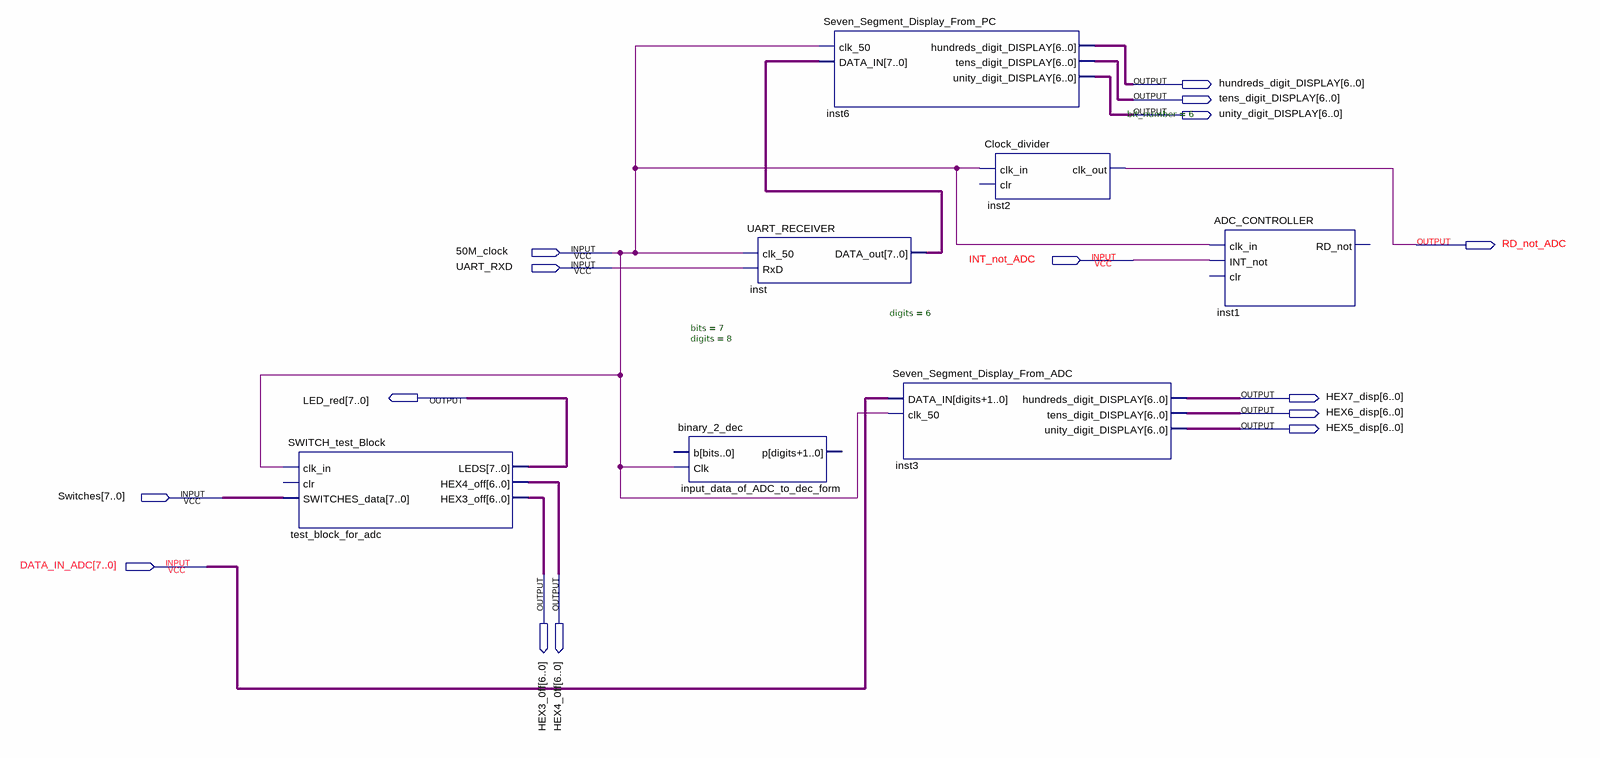
[diagram p0: schematic sheet]
// Quartus schematic SEPIC_BC_BD.bdf as structural Verilog: 7 symbols, 15 pins
module SEPIC_BC_BD (
  input  \50M_clock ,
  input  INT_not_ADC,
  input  UART_RXD,
  input  [7:0] Switches,
  input  [7:0] DATA_IN_ADC,
  output [6:0] hundreds_digit_DISPLAY,
  output [6:0] tens_digit_DISPLAY,
  output [6:0] unity_digit_DISPLAY,
  output RD_not_ADC,
  output [7:0] LED_red,
  output [6:0] HEX7_disp,
  output [6:0] HEX6_disp,
  output [6:0] HEX5_disp,
  output [6:0] HEX3_0ff,
  output [6:0] HEX4_0ff
);

  wire [7:0] inst_data_out;

  SWITCH_test_Block test_block_for_adc (
    .clk_in(\50M_clock ), .SWITCHES_data(Switches), .LEDS(LED_red), .HEX4_off(HEX4_0ff), .HEX3_off(HEX3_0ff));  // open: clr
  binary_2_dec #(.bits(7), .digits(8)) input_data_of_ADC_to_dec_form (.Clk(\50M_clock ));  // open: b, p
  UART_RECEIVER inst (.clk_50(\50M_clock ), .RxD(UART_RXD), .DATA_out(inst_data_out));
  Seven_Segment_Display_From_PC inst6 (
    .clk_50(\50M_clock ), .DATA_IN(inst_data_out), .hundreds_digit_DISPLAY(hundreds_digit_DISPLAY),
    .tens_digit_DISPLAY(tens_digit_DISPLAY), .unity_digit_DISPLAY(unity_digit_DISPLAY));
  Seven_Segment_Display_From_ADC #(.digits(6)) inst3 (
    .DATA_IN(DATA_IN_ADC), .clk_50(\50M_clock ), .hundreds_digit_DISPLAY(HEX7_disp),
    .tens_digit_DISPLAY(HEX6_disp), .unity_digit_DISPLAY(HEX5_disp));
  Clock_divider #(.bit_number(6)) inst2 (.clk_in(\50M_clock ), .clk_out(RD_not_ADC));  // open: clr
  ADC_CONTROLLER inst1 (.clk_in(\50M_clock ), .INT_not(INT_not_ADC));  // open: clr, RD_not
endmodule
